# EAGLE schematic braino_schematic (EAGLE 7.7.0)
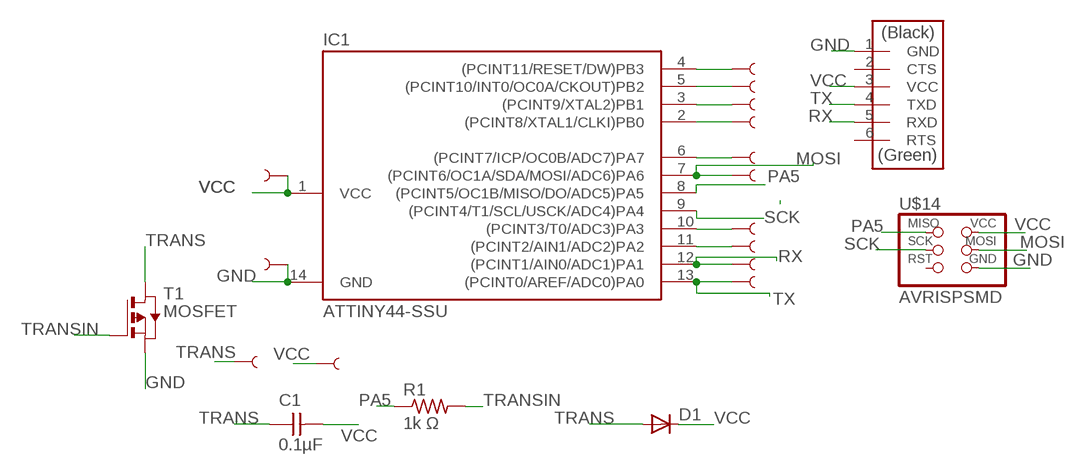
[diagram p0: schematic, sheet 1]

## Parts
C1  0.1µF  CAP-UNPOLARIZEDFAB  [C1206FAB]
D1  DIODESOD123  [SOD123]
IC1  ATTINY44-SSU  [SOIC14]
R1  1k Ω  RES-US1206FAB  [R1206FAB]
T1  MOSFET  PMOSFETSOT23  [SOT-23]
U$1  SEWTAP10  [PETAL-LONG-2-2SIDE]
U$2  SEWTAP10  [PETAL-LONG-2-2SIDE]
U$3  SEWTAP10  [PETAL-LONG-2-2SIDE]
U$4  SEWTAP10  [PETAL-LONG-2-2SIDE]
U$5  SEWTAP10  [PETAL-LONG-2-2SIDE]
U$6  SEWTAP10  [PETAL-LONG-2-2SIDE]
U$9  SEWTAP10  [PETAL-LONG-2-2SIDE]
U$10  SEWTAP10  [PETAL-LONG-2-2SIDE]
U$11  SEWTAP10  [PETAL-LONG-2-2SIDE]
U$12  SEWTAP10  [PETAL-LONG-2-2SIDE]
U$13  FTDI-SMD-HEADER  [1X06SMD]
U$14  AVRISPSMD  [2X03SMD]
U$15  SEWTAP10  [PETAL-LONG-2-2SIDE]
U$16  SEWTAP10  [PETAL-LONG-2-2SIDE]
U$17  SEWTAP11  [PETAL-TINY]
U$18  SEWTAP11  [PETAL-TINY]

## Nets
GND: IC1.14(GND) T1.2(S) U$13.1(GND) U$14.6(GND) U$15.1
MOSI: IC1.7((PCINT6/OC1A/SDA/MOSI/ADC6)PA6) U$6.1 U$14.4(MOSI)
N$1: IC1.4((PCINT11/RESET/DW)PB3) U$1.1
N$2: IC1.5((PCINT10/INT0/OC0A/CKOUT)PB2) U$2.1
N$3: IC1.3((PCINT9/XTAL2)PB1) U$3.1
N$4: IC1.2((PCINT8/XTAL1/CLKI)PB0) U$4.1
N$5: IC1.6((PCINT7/ICP/OC0B/ADC7)PA7) U$5.1
N$8: IC1.10((PCINT3/T0/ADC3)PA3) U$9.1
N$9: IC1.11((PCINT2/AIN1/ADC2)PA2) U$10.1
PA5: IC1.8((PCINT5/OC1B/MISO/DO/ADC5)PA5) R1.1 U$14.1(MISO)
RX: IC1.12((PCINT1/AIN0/ADC1)PA1) U$11.1 U$13.5(RXD)
SCK: IC1.9((PCINT4/T1/SCL/USCK/ADC4)PA4) U$14.3(SCK)
TRANS: C1.1 D1.ANODE(A) T1.1(D) U$18.1
TRANSIN: R1.2 T1.3(G)
TX: IC1.13((PCINT0/AREF/ADC0)PA0) U$12.1 U$13.4(TXD)
VCC: C1.2 D1.CATHODE(C) IC1.1(VCC) U$13.3(VCC) U$14.2(VCC) U$16.1 U$17.1
Unconnected: U$13.2(CTS) U$13.6(RTS) U$14.5(RST)

## Library data of the parts
C1 = 0_fab:CAP-UNPOLARIZED
D1 = 0_fab:DIODE: DIODE high speed (Philips)
IC1 = 0_fab:ATTINY44
R1 = 0_fab:RES-US: Resistor (US Symbol) Variants with postfix FAB are widened to allow the routing of internal traces
T1 = 0_fab:PMOSFET: MOS FET
U$1-U$6 U$9-U$12 U$15-U$18 = LilyPad-Wearables:SEWTAP
U$13 = 0_fab:FTDI-SMD-HEADER
U$14 = 0_fab:AVRISP